# Altium schematic sheet Top.SchDoc
size B; SheetNumber: 1; SheetTotal: 7
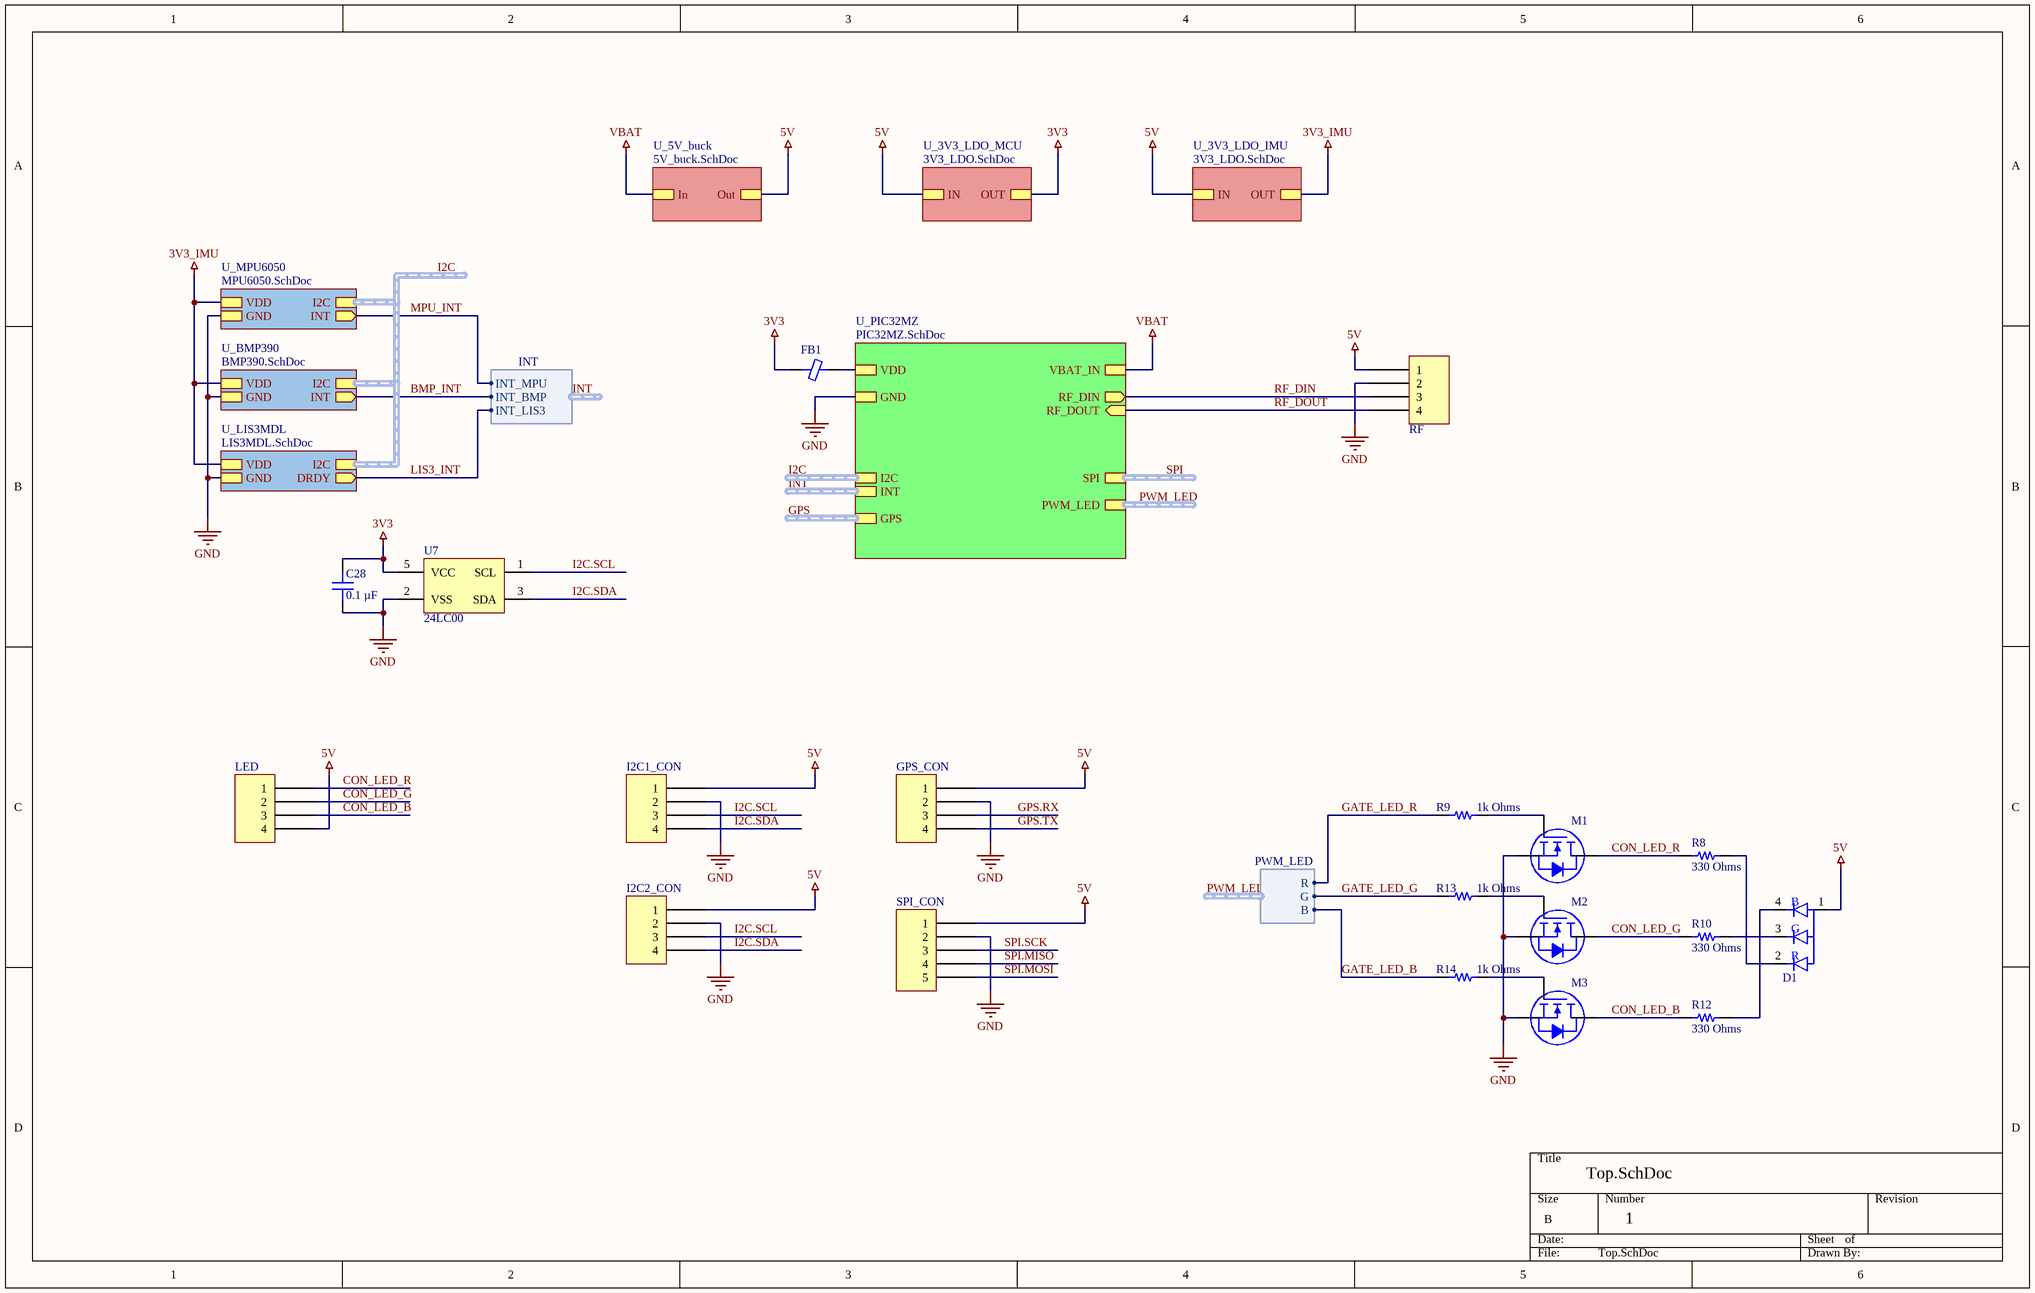
[diagram p0: Top.SchDoc]

## Parts
C28  0.1 µF  [CAP 0402_1005]
D1  RGB LED 3228  [CreeLED 3228]  (value not drawn)
FB1  (no value)  [FER 0805_2012]
GPS_CON  SM04B-SRSS-TB(LF)(SN)  [JST SM04B-SRSS-TB]  (value not drawn)
I2C1_CON  SM04B-SRSS-TB(LF)(SN)  [JST SM04B-SRSS-TB]  (value not drawn)
I2C2_CON  SM04B-SRSS-TB(LF)(SN)  [JST SM04B-SRSS-TB]  (value not drawn)
LED  SM04B-SRSS-TB(LF)(SN)  [JST SM04B-SRSS-TB]  (value not drawn)
M1  BSS123-7-F  [DIODES SOT-23-3]  (value not drawn)
M2  BSS123-7-F  [DIODES SOT-23-3]  (value not drawn)
M3  BSS123-7-F  [DIODES SOT-23-3]  (value not drawn)
R8  330 Ohms  [RES 0603_1608]
R9  1k Ohms  [RES 0402_1005]
R10  330 Ohms  [RES 0603_1608]
R12  330 Ohms  [RES 0603_1608]
R13  1k Ohms  [RES 0402_1005]
R14  1k Ohms  [RES 0402_1005]
RF  SM04B-SRSS-TB(LF)(SN)  [JST SM04B-SRSS-TB]  (value not drawn)
SPI_CON  SM05B-SRSS-TB(LF)(SN)  [JST SM05B-SRSS-TB]  (value not drawn)
U7  24LC00  [SOT-23-5]

## Sub-sheets
U_3V3_LDO_IMU = 3V3_LDO.SchDoc: OUT, IN
U_3V3_LDO_MCU = 3V3_LDO.SchDoc: OUT, IN
U_5V_buck = 5V_buck.SchDoc: Out, In
U_BMP390 = BMP390.SchDoc: VDD, GND, I2C (harness I2C), INT (out)
U_LIS3MDL = LIS3MDL.SchDoc: VDD, GND, I2C (harness I2C), DRDY (out)
U_MPU6050 = MPU6050.SchDoc: VDD, GND, I2C (harness I2C), INT (out)
U_PIC32MZ = PIC32MZ.SchDoc: RF_DIN (out), RF_DOUT (in), GND, VDD, VBAT_IN, I2C (harness I2C), GPS (harness GPS), PWM_LED (harness PWM_LED), INT (harness INT), SPI (harness SPI)

## Harnesses
PWM_LED: R, B, G
INT: INT_MPU, INT_BMP, INT_LIS3

## Nets
3V3: C28.2 FB1.1 U7.5(VCC) ; sheet U_3V3_LDO_MCU/OUT
3V3_IMU: sheet U_3V3_LDO_IMU/OUT, sheet U_MPU6050/VDD, sheet U_BMP390/VDD, sheet U_LIS3MDL/VDD
5V: D1.1(A) GPS_CON.1 I2C1_CON.1 I2C2_CON.1 LED.4 RF.1 SPI_CON.1 ; sheet U_3V3_LDO_MCU/IN, sheet U_3V3_LDO_IMU/IN, sheet U_5V_buck/Out
GND: C28.1 GPS_CON.2 I2C1_CON.2 I2C2_CON.2 M1.2(S) M2.2(S) M3.2(S) RF.2 SPI_CON.2 U7.2(VSS) ; sheet U_PIC32MZ/GND, sheet U_MPU6050/GND, sheet U_BMP390/GND, sheet U_LIS3MDL/GND
VBAT: sheet U_PIC32MZ/VBAT_IN, sheet U_5V_buck/In
BMP_INT: sheet U_BMP390/INT, sheet U_PIC32MZ/INT.INT_BMP
CON_LED_B: LED.3 M3.3(D) R12.1
CON_LED_G: LED.2 M2.3(D) R10.1
CON_LED_R: LED.1 M1.3(D) R8.1
GATE_LED_B: R14.2 ; sheet U_PIC32MZ/PWM_LED.B
GATE_LED_G: R13.2 ; sheet U_PIC32MZ/PWM_LED.G
GATE_LED_R: R9.2 ; sheet U_PIC32MZ/PWM_LED.R
GPS.RX: GPS_CON.3
GPS.TX: GPS_CON.4
I2C.SCL: I2C1_CON.3 I2C2_CON.3 U7.1(SCL)
I2C.SDA: I2C1_CON.4 I2C2_CON.4 U7.3(SDA)
LIS3_INT: sheet U_LIS3MDL/DRDY, sheet U_PIC32MZ/INT.INT_LIS3  [project net INT.INT_LIS3]
MPU_INT: sheet U_MPU6050/INT, sheet U_PIC32MZ/INT.INT_MPU  [project net INT.INT_MPU]
RF_DIN: RF.3 ; sheet U_PIC32MZ/RF_DIN
RF_DOUT: RF.4 ; sheet U_PIC32MZ/RF_DOUT
SPI.MISO: SPI_CON.4
SPI.MOSI: SPI_CON.5
SPI.SCK: SPI_CON.3
NetD1_2: D1.2(BLUE(C)) R8.2
NetD1_3: D1.3(BLUE(C)) R10.2
NetD1_4: D1.4(BLUE(C)) R12.2
NetFB1_2: FB1.2 ; sheet U_PIC32MZ/VDD
NetM1_1: M1.1(G) R9.1
NetM2_1: M2.1(G) R13.1
NetM3_1: M3.1(G) R14.1

## Buses and harness runs
harness GPS = sheet U_PIC32MZ/GPS
harness I2C = sheet U_BMP390/I2C = sheet U_LIS3MDL/I2C = sheet U_MPU6050/I2C
harness I2C = sheet U_PIC32MZ/I2C
harness INT = sheet U_PIC32MZ/INT
harness PWM_LED = sheet U_PIC32MZ/PWM_LED
harness SPI = sheet U_PIC32MZ/SPI

## Notes on the sheet
- (in symbol RGB LED 3228) B; G; R

## Library data of the parts
C28 = C0402C104K4RACAUTO: CAP CER 0.1UF 16V X7R 0402; manufacturer: KEMET; Tolerance: ±10%; Part Number: C0402C104K4RACAUTO; Value: 0.1 µF; Applications: Automotive, Bypass, Decoupling; Capacitance: 0.1 µF; componentlink1description: Datasheet; componentlink1url: https://api.kemet.com/component-edge/download/specsheet/C0402C104K4RACAUTO.pdf; componentlink2description: DigiKey Link; componentlink2url: https://www.digikey.com/en/products/detail/kemet/C0402C104K4RACAUTO/3314827; Device Package: 0402 (1005 Metric); lastupdated: 8/14/2022 9:05:51 PM; Lifecycle Status: Active; Minimum Order: 1; Mounting Type: Surface Mount, MLCC; Operating Temperature: -55°C ~ 125°C; Package / Case: 0402 (1005 Metric); packaging: TapeAndReel; partid: 3024; Part Status: Active; price: 0.01; Ratings: AEC-Q200; series: SMD Auto X7R; Size / Dimension: 0.039" L x 0.020" W (1.00mm x 0.50mm); Supplier 1: DigiKey; Supplier Part Number 1: 399-6828-1-ND; Temperature Coefficient: X7R; Thickness (Max): 0.022" (0.55mm); Voltage - Rated: 16V
D1 = RGB LED 3228: DIODE LED RGB DIFFUSED 4LCC SMD CLV1L-FKB-CJ1N1E1BB7B3B3; Manufacturer: Cree; ComponentLink2Description: Datasheet; Temperature: -40°C to +100°C; Package: LED_3MM2X2MM8; Supplier 2: Mouser; Price: 0.203999996142; Supplier 1: Digi-Key; ComponentLink1URL: https://upverter.com/upn/revision/9d0b31f7b1982705/; Supplier Part Number 2: 941-CLV1LFKBC7673673; Supplier Part Number 1: CLV1L-FKB-CHMMQEHBB7673673-ND; ComponentLink1Description: Upverter; ComponentLink2URL: http://www.cree.com/~/media/Files/Cree/LED-Components-and-Modules/HB/Data-Sheets/CLV1L-FKB-1238.pdf; RoHS: TRUE; Mouser Part Number: 941-CLV1LFKBC7673673; Temperature Range High: +100°C; Digikey Description: DIODE LED RGB DIFFUSED 4LCC SMD; Digikey Part Number: CLV1L-FKB-CHMMQEHBB7673673-ND; Lead Free: yes; Temperature Range Low: -40°C
FB1 = 2508051017Y0: FERRITE BEAD 0805 1LN; Manufacturer: Fair-Rite Products Corp.; Current Rating (Max): 300mA; DC Resistance (DCR) (Max): 200mOhm; Filter Type: Signal Line; Number of Lines: 1; Part Number: 2508051017Y0; ComponentLink1Description: Datasheet; ComponentLink1URL: http://www.fair-rite.com/wp-content/themes/fair-rite/print_product.php?pid=19091; ComponentLink2Description: DigiKey Link; ComponentLink2URL: http://digikey.com/product-detail/en/fair-rite-products-corp/2508051017Y0/1934-1435-1-ND/8594382; Device Package: 0805 (2012 Metric); Height (Max): 0.043" (1.10mm); LastUpdated: 9/2/2020 1:18:22 AM; Lifecycle Status: Active; Minimum Order: 1; Mounting Type: Surface Mount; Operating Temperature: -55°C ~ 125°C; Package / Case: 0805 (2012 Metric); Packaging: TapeAndReel; PartId: 1308; Part Status: Active; Price: 0.02; Series: -; Size / Dimension: 0.079" L x 0.049" W (2.00mm x 1.25mm); Supplier 1: DigiKey; Supplier Part Number 1: 1934-1435-1-ND
GPS_CON I2C1_CON I2C2_CON LED RF = SM04B-SRSS-TB(LF)(SN): CONN HEADER SMD R/A 4POS 1MM; Manufacturer: JST Sales America Inc.; Current Rating (Amps): 0.7A; Material Flammability Rating: UL94 V-0; Number of Positions: 4; Number of Positions Loaded: All; Pitch - Mating: 0.039" (1.00mm); Shrouding: Shrouded - 4 Wall; Style: Board to Cable/Wire; Voltage Rating: 50V; Part Number: SM04B-SRSS-TB(LF)(SN); ComponentLink1Description: Datasheet; ComponentLink1URL: http://www.jst-mfg.com/product/pdf/eng/eSH.pdf; ComponentLink2Description: DigiKey Link; ComponentLink2URL: http://digikey.com/product-detail/en/jst-sales-america-inc/SM04B-SRSS-TB-LF-SN/455-1804-1-ND/926875; Connector Type: Header; Contact Finish - Mating: Tin; Contact Finish - Post: Tin; Contact Material: Copper Alloy; Contact Shape: Square; Contact Type: Male Pin; Fastening Type: Push-Pull; Features: Solder Retention; Insulation Color: Natural; Insulation Height: 0.114" (2.90mm); Insulation Material: Polyamide (PA), Nylon; LastUpdated: 1/12/2020 11:41:52 PM; Lifecycle Status: Active; Minimum Order: 1; Mounting Type: Surface Mount, Right Angle; Number of Rows: 1; Operating Temperature: -25°C ~ 85°C; Packaging: TapeAndReel; PartId: 62; Part Status: Active; Price: 0.26; Series: SR; Supplier 1: DigiKey; Supplier Part Number 1: 455-1804-1-ND; Termination: Solder
M1-M3 = BSS123-7-F: MOSFET N-CH 100V 170MA SOT23-3; Manufacturer: Diodes Incorporated; Current - Continuous Drain (Id) @ 25°C: 170mA (Ta); Drive Voltage (Max Rds On,  Min Rds On): 10V; FET Type: N-Channel; Input Capacitance (Ciss) (Max) @ Vds: 60pF @ 25V; Power Dissipation (Max): 300mW (Ta); Rds On (Max) @ Id, Vgs: 6Ohm @ 170mA, 10V; Vgs (Max): ±20V; Vgs(th) (Max) @ Id: 2V @ 1mA; Part Number: BSS123-7-F; ComponentLink1Description: Datasheet; ComponentLink1URL: https://www.diodes.com/assets/Datasheets/ds30366.pdf; ComponentLink2Description: DigiKey Link; ComponentLink2URL: http://digikey.com/product-detail/en/diodes-incorporated/BSS123-7-F/BSS123-FDICT-ND/717842; Drain to Source Voltage (Vdss): 100V; LastUpdated: 8/14/2022 10:06:21 PM; Lifecycle Status: Active; Minimum Order: 1; Mounting Type: Surface Mount; Operating Temperature: -55°C ~ 150°C (TJ); Package / Case: TO-236-3, SC-59, SOT-23-3; Packaging: TapeAndReel; Part Status: Active; Price: 0.05; Series: -; Supplier 1: DigiKey; Supplier Part Number 1: BSS123-FDICT-ND; Supplier Device Package: SOT-23-3; Technology: MOSFET (Metal Oxide)
R8 R10 R12 = RNCS0603BKE10K0: RES 10K OHM 0.1% 1/16W 0603; Manufacturer: Stackpole Electronics Inc; Power (Watts): 0.063W, 1/16W; Resistance: 10 kOhms; Temperature Coefficient: ±25ppm/°C; Part Number: RNCS0603BKE10K0; Value: 330 Ohms; ComponentLink1Description: Datasheet; ComponentLink1URL: https://www.seielect.com/catalog/sei-rncs_rnch.pdf; ComponentLink2Description: DigiKey Link; ComponentLink2URL: https://www.digikey.com/en/products/detail/stackpole-electronics-inc/RNCS0603BKE10K0/1708836; Composition: Thin Film; Device Package: 0603 (1608 Metric); Features: Anti-Corrosive, Automotive AEC-Q200, Moisture Resistant; Height - Seated (Max): 0.022" (0.55mm); LastUpdated: 8/14/2022 9:31:27 PM; Lifecycle Status: Active; Minimum Order: 1; Number of Terminations: 2; Operating Temperature: -55°C ~ 155°C; Package / Case: 0603 (1608 Metric); Packaging: TapeAndReel; PartId: 4838; Part Status: Active; Price: 0.08; Ratings: AEC-Q200; Series: RNCS; Size / Dimension: 0.061" L x 0.031" W (1.55mm x 0.80mm); Supplier 1: DigiKey; Supplier Part Number 1: RNCS0603BKE10K0CT-ND; Supplier Device Package: 0603; Tolerance: ±0.1%
R9 R13 R14 = CRCW0402330RJNEDC: RES 330 OHM 5% 1/16W 0402; Manufacturer: Vishay Dale; Power (Watts): 0.063W, 1/16W; Resistance: 330 Ohms; Temperature Coefficient: ±200ppm/°C; Part Number: CRCW0402330RJNEDC; Value: 1k Ohms; ComponentLink1Description: Datasheet; ComponentLink1URL: http://www.vishay.com/docs/28773/crcwce3.pdf; ComponentLink2Description: DigiKey Link; ComponentLink2URL: https://www.digikey.com/en/products/detail/vishay-dale/CRCW0402330RJNEDC/7928545; Composition: Thick Film; Device Package: 0402 (1005 Metric); Height - Seated (Max): 0.014" (0.35mm); LastUpdated: 8/14/2022 9:23:31 PM; Lifecycle Status: Active; Minimum Order: 1; Number of Terminations: 2; Operating Temperature: -55°C ~ 155°C; Package / Case: 0402 (1005 Metric); Packaging: CutTape; PartId: 15989; Part Status: Active; Price: 0.01; Series: CRCW-C; Size / Dimension: 0.039" L x 0.020" W (1.00mm x 0.50mm); Supplier 1: DigiKey; Supplier Part Number 1: 541-4123-1-ND; Supplier Device Package: 0402; Tolerance: ±5%
SPI_CON = SM05B-SRSS-TB(LF)(SN): CONN HEADER SMD R/A 5POS 1MM; Manufacturer: JST Sales America Inc.; Current Rating (Amps): 0.7A; Material Flammability Rating: UL94 V-0; Number of Positions: 5; Number of Positions Loaded: All; Pitch - Mating: 0.039" (1.00mm); Shrouding: Shrouded - 4 Wall; Style: Board to Cable/Wire; Voltage Rating: 50V; Part Number: SM05B-SRSS-TB(LF)(SN); ComponentLink1Description: Datasheet; ComponentLink1URL: http://www.jst-mfg.com/product/pdf/eng/eSH.pdf; ComponentLink2Description: DigiKey Link; ComponentLink2URL: http://digikey.com/product-detail/en/jst-sales-america-inc/SM05B-SRSS-TB-LF-SN/455-1805-1-ND/926876; Connector Type: Header; Contact Finish - Mating: Tin; Contact Finish - Post: Tin; Contact Material: Copper Alloy; Contact Shape: Square; Contact Type: Male Pin; Fastening Type: Push-Pull; Features: Solder Retention; Insulation Color: Natural; Insulation Height: 0.114" (2.90mm); Insulation Material: Polyamide (PA), Nylon; LastUpdated: 1/12/2020 11:42:04 PM; Lifecycle Status: Active; Minimum Order: 1; Mounting Type: Surface Mount, Right Angle; Number of Rows: 1; Operating Temperature: -25°C ~ 85°C; Packaging: TapeAndReel; PartId: 63; Part Status: Active; Price: 0.32; Series: SR; Supplier 1: DigiKey; Supplier Part Number 1: 455-1805-1-ND; Termination: Solder
U7 = 24LC00: EEPROM